# EAGLE schematic rfv1 (EAGLE 6.5.0)
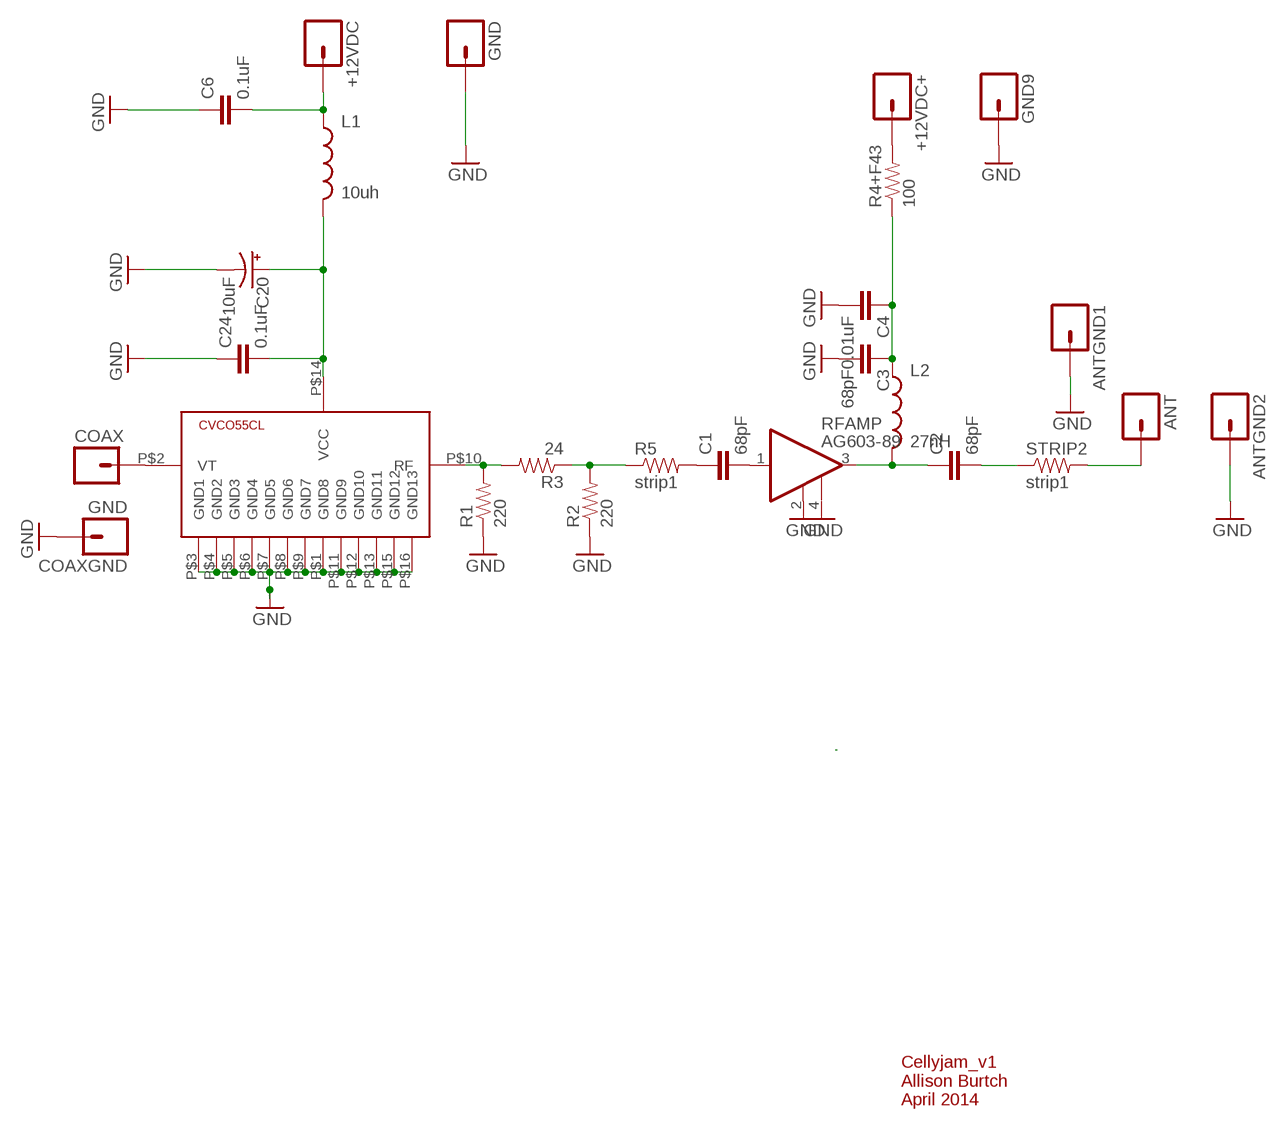
[diagram p0: schematic, sheet 1]

## Parts
+12VDC  M01OFFSET  [1X01_OFFSET]
+12VDC+  M01OFFSET  [1X01_OFFSET]
ANT  M01OFFSET  [1X01_OFFSET]
ANTGND1  M01OFFSET  [1X01_OFFSET]
ANTGND2  M01OFFSET  [1X01_OFFSET]
C1  68pF  CAP0603-CAP  [0603-CAP]
C2  68pF  CAP0603-CAP  [0603-CAP]
C3  68pF  CAP0603-CAP  [0603-CAP]
C4  0.01uF  CAP0603-CAP  [0603-CAP]
C6  0.1uF  CAP0603-CAP  [0603-CAP]
C20  10uF  CAP_POLC  [PANASONIC_C]
C24  0.1uF  CAP0603-CAP  [0603-CAP]
COAX  M01OFFSET  [1X01_OFFSET]
COAXGND  GND  M01OFFSET  [1X01_OFFSET]
GND  M01OFFSET  [1X01_OFFSET]
GND9  M01OFFSET  [1X01_OFFSET]
L1  10uh  INDUCTOR0603  [0603]
L2  27nH  INDUCTOR0603  [0603]
R1  220  RESISTOR0603-RES  [0603-RES]
R2  220  RESISTOR0603-RES  [0603-RES]
R3  24  RESISTOR0603-RES  [0603-RES]
R4+F43  100  RESISTORKIT  [AXIAL-0.3-KIT]
R5  strip1  1.2MOHMS-1/10W-1%(0603)  [0603-RES]
RFAMP  AG603-89  GALI-3+  [SOT89]
STRIP2  strip1  1.2MOHMS-1/10W-1%(0603)  [0603-RES]
U$1  CVCO55CL  [CVCO55CL]

## Nets
GND: ANTGND1.1 ANTGND2.1 C3.2 C4.2 C6.1 C20.- C24.1 COAXGND.1 GND9.1 GND.1 R1.1 R2.1 RFAMP.2(GND) RFAMP.4(GND) U$1.P$1(GND8) U$1.P$3(GND1) U$1.P$4(GND2) U$1.P$5(GND3) U$1.P$6(GND4) U$1.P$7(GND5) U$1.P$8(GND6) U$1.P$9(GND7) U$1.P$11(GND9) U$1.P$12(GND10) U$1.P$13(GND11) U$1.P$15(GND12) U$1.P$16(GND13)
N$1: COAX.1 U$1.P$2(VT)
N$2: R1.2 R3.2 U$1.P$10(RF)
N$3: R2.2 R3.1 R5.1
N$4: C1.2 RFAMP.1(IN)
N$5: C2.1 L2.2 RFAMP.3(OUT)
N$6: C3.1 C4.1 L2.1 R4+F43.P$1
N$7: +12VDC.1 C6.2 L1.1
N$8: +12VDC+.1 R4+F43.P$2
N$9: C2.2 STRIP2.1
N$10: ANT.1 STRIP2.2
N$11: C1.1 R5.2
N$37: C20.+ C24.2 L1.2 U$1.P$14(VCC)

## Notes on the sheet
- Cellyjam_v1
  Allison Burtch 
  April 2014

## Library data of the parts
+12VDC +12VDC+ ANT ANTGND1 ANTGND2 COAX COAXGND GND GND9 = SparkFun-Connectors:M01: Header 1 Standard 1-pin 0.1" header. Use with straight break away headers (SKU : PRT-00116), right angle break away headers (PRT-00553), swiss pins (PRT-00743), machine pins (PRT-00117), and female headers (PRT-00115).
C1-C4 = SparkFun-Capacitors:CAP: Capacitor Standard 0603 ceramic capacitor, and 0.1" leaded capacitor.
C6 C24 = SparkFun-Passives:CAP: Capacitor Standard 0603 ceramic capacitor, and 0.1" leaded capacitor.
C20 = SparkFun-Capacitors:CAP_POL: Capacitor Polarized These are standard SMD and PTH capacitors. Normally 10uF, 47uF, and 100uF in electrolytic and tantalum varieties. Always verify the external diameter of the through hole cap, it varies with capacity, voltage, and manufacturer. The EIA devices should be standard.
L1 L2 = SparkFun-Passives:INDUCTOR: Inductors Basic Inductor/Choke - 0603 and 1206. Footprints are not proven and vary greatly between part numbers. SRN6045- 33uH, 20% 1.4A SDR0403-560KL - 56uH, 10%, 500mA RMS/740mA peak
R1-R3 = SparkFun-Passives:RESISTOR: Resistor Basic schematic elements and footprints for 0603, 1206, and PTH resistors.
R4+F43 = SparkFun-Resistors:RESISTOR: Resistor Basic schematic elements and footprints for 0603, 1206, and PTH resistors.
R5 STRIP2 = SparkFun-Resistors:1.2MOHMS-1/10W-1%(0603): RES-10055; PROD_ID: RES-10055; VALUE: 1.2M
RFAMP = mini-circuits:GALI-3+: Monolithic RF Amplifier
U$1 = crystec_vco:CVCO55CL: Volatage Controlled Oscillator - VCO Vendor: CRYSTEK MICROWAVE Series: CVCO-55CL